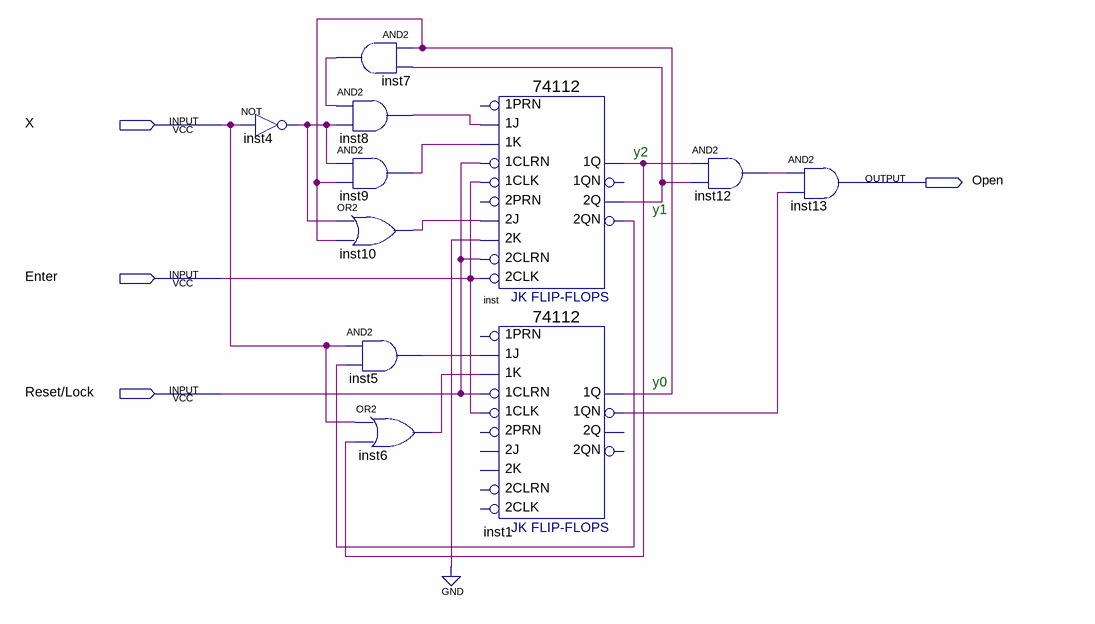
[diagram p0: schematic sheet]
// Quartus schematic Lab9.bdf as structural Verilog: 11 symbols, 4 pins
module Lab9 (
  input  X,
  input  Enter,
  input  \Reset/Lock ,
  output Open
);

  wire inst1_1q, inst1_1qn, inst4_out, inst5_out, inst6_out, inst7_out, inst8_out, inst9_out, inst10_out,
       inst12_out, inst_1q, inst_2q, inst_2qn;

  not inst4 (inst4_out, X);
  and inst7 (inst7_out, inst1_1q, inst_2q);
  and inst8 (inst8_out, inst7_out, inst4_out);
  and inst9 (inst9_out, inst4_out, inst1_1q);
  or inst10 (inst10_out, inst4_out, inst1_1q);
  and inst5 (inst5_out, X, inst_2qn);
  or inst6 (inst6_out, X, inst_1q);
  \74112  inst (
    .\1K (inst9_out), .\1J (inst8_out), .\1CLK (Enter), .\1CLRN (\Reset/Lock ), .\2K (1'b0),
    .\2J (inst10_out), .\2CLK (Enter), .\2CLRN (\Reset/Lock ), .\2Q (inst_2q), .\1Q (inst_1q),
    .\2QN (inst_2qn));  // open: 1PRN, 2PRN, 1QN
  \74112  inst1 (
    .\1K (inst6_out), .\1J (inst5_out), .\1CLK (Enter), .\1CLRN (\Reset/Lock ), .\1QN (inst1_1qn),
    .\1Q (inst1_1q));  // open: 1PRN, 2K, 2J, 2PRN, 2CLK, 2CLRN, 2Q, 2QN
  and inst12 (inst12_out, inst_1q, inst_2q);
  and inst13 (Open, inst12_out, inst1_1qn);

  // Notes on the sheet:
  //   y2
  //   y1
  //   y0
endmodule
